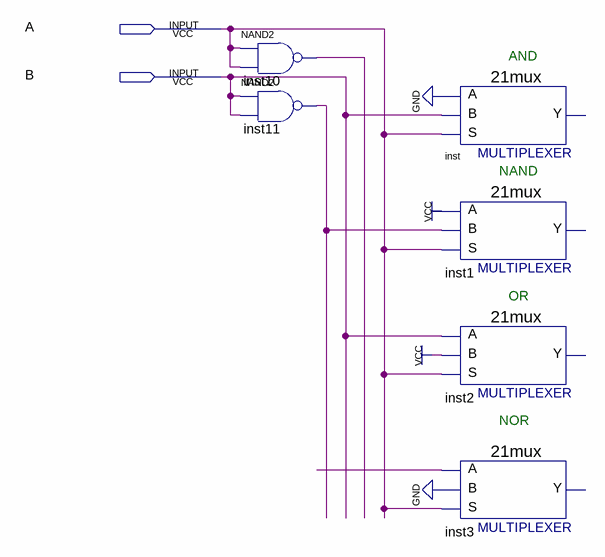
[diagram p0: schematic sheet]
// Quartus schematic lab3_g8_p2.bdf as structural Verilog: 6 symbols, 2 pins
module lab3_g8_p2 (
  input  A,
  input  B
);

  wire inst10_out, inst11_out, undriven;

  nand inst10 (inst10_out, A, A);
  nand inst11 (inst11_out, B, B);
  \21mux  inst (.S(A), .B(B), .A(1'b0));  // open: Y
  \21mux  inst1 (.S(A), .B(inst11_out), .A(1'b1));  // open: Y
  \21mux  inst2 (.S(A), .B(1'b1), .A(B));  // open: Y
  \21mux  inst3 (.S(A), .B(1'b0), .A(undriven));  // open: Y

  // Notes on the sheet:
  //   AND
  //   NAND
  //   OR
  //   NOR
endmodule
